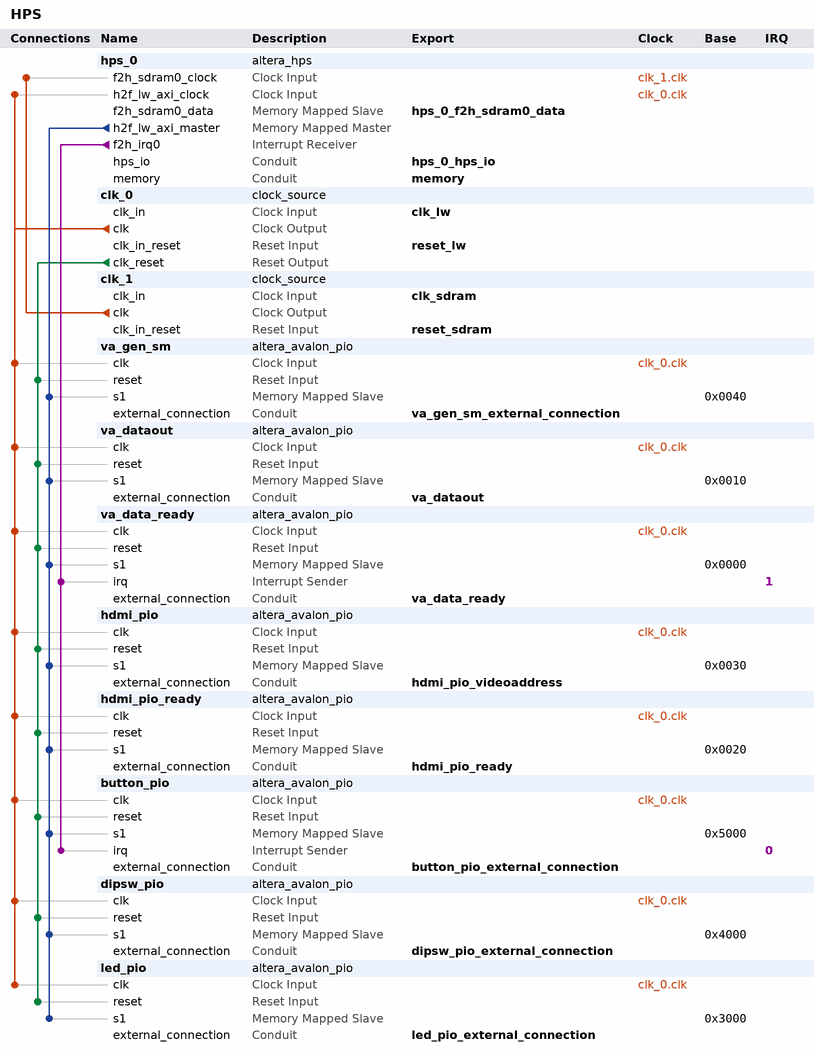
[diagram p0: system contents]
# Platform Designer (Qsys) system HPS, Cyclone V 5CSEBA6U23I7
# Parameters at their usual value, and those the tool derives, are not listed.
package require -exact qsys 16.0
create_system HPS
set_project_property DEVICE_FAMILY {Cyclone V}
set_project_property DEVICE 5CSEBA6U23I7

add_instance hps_0 altera_hps 16.0
set_instance_parameter_value hps_0 EMAC1_Mode N/A
set_instance_parameter_value hps_0 EMAC1_PinMuxing Unused
set_instance_parameter_value hps_0 F2SCLK_COLDRST_Enable false
set_instance_parameter_value hps_0 F2SCLK_DBGRST_Enable false
set_instance_parameter_value hps_0 F2SCLK_WARMRST_Enable false
set_instance_parameter_value hps_0 F2SDRAM_Type {Avalon-MM Read-Only}
set_instance_parameter_value hps_0 F2SDRAM_Width 64
set_instance_parameter_value hps_0 F2SINTERRUPT_Enable true
set_instance_parameter_value hps_0 F2S_Width 0
set_instance_parameter_value hps_0 FPGA_PERIPHERAL_OUTPUT_CLOCK_FREQ_EMAC0_GTX_CLK 100
set_instance_parameter_value hps_0 FPGA_PERIPHERAL_OUTPUT_CLOCK_FREQ_EMAC0_MD_CLK 100.0
set_instance_parameter_value hps_0 FPGA_PERIPHERAL_OUTPUT_CLOCK_FREQ_EMAC1_GTX_CLK 100
set_instance_parameter_value hps_0 FPGA_PERIPHERAL_OUTPUT_CLOCK_FREQ_EMAC1_MD_CLK 100.0
set_instance_parameter_value hps_0 HPS_PROTOCOL DDR3
set_instance_parameter_value hps_0 I2C0_Mode N/A
set_instance_parameter_value hps_0 I2C0_PinMuxing Unused
set_instance_parameter_value hps_0 I2C1_Mode N/A
set_instance_parameter_value hps_0 I2C1_PinMuxing Unused
set_instance_parameter_value hps_0 LWH2F_Enable true
set_instance_parameter_value hps_0 MEM_BANKADDR_WIDTH 3
set_instance_parameter_value hps_0 MEM_CLK_FREQ 400.0
set_instance_parameter_value hps_0 MEM_COL_ADDR_WIDTH 10
set_instance_parameter_value hps_0 MEM_DQ_WIDTH 32
set_instance_parameter_value hps_0 MEM_DRV_STR RZQ/6
set_instance_parameter_value hps_0 MEM_ROW_ADDR_WIDTH 15
set_instance_parameter_value hps_0 MEM_RTT_NOM RZQ/6
set_instance_parameter_value hps_0 MEM_RTT_WR {Dynamic ODT off}
set_instance_parameter_value hps_0 MEM_TCL 7
set_instance_parameter_value hps_0 MEM_TFAW_NS 37.5
set_instance_parameter_value hps_0 MEM_TRAS_NS 35.0
set_instance_parameter_value hps_0 MEM_TRCD_NS 13.75
set_instance_parameter_value hps_0 MEM_TRFC_NS 300.0
set_instance_parameter_value hps_0 MEM_TRP_NS 13.75
set_instance_parameter_value hps_0 MEM_VENDOR Other
set_instance_parameter_value hps_0 MEM_WTCL 7
set_instance_parameter_value hps_0 QSPI_Mode N/A
set_instance_parameter_value hps_0 QSPI_PinMuxing Unused
set_instance_parameter_value hps_0 REF_CLK_FREQ 25.0
set_instance_parameter_value hps_0 S2FCLK_USER2CLK 4
set_instance_parameter_value hps_0 S2F_Width 0
set_instance_parameter_value hps_0 SDIO_Mode {4-bit Data}
set_instance_parameter_value hps_0 SDIO_PinMuxing {HPS I/O Set 0}
set_instance_parameter_value hps_0 SPIM1_Mode N/A
set_instance_parameter_value hps_0 SPIM1_PinMuxing Unused
set_instance_parameter_value hps_0 STM_Enable false
set_instance_parameter_value hps_0 TIMING_BOARD_AC_SKEW 0.02
set_instance_parameter_value hps_0 TIMING_BOARD_AC_TO_CK_SKEW 0.0
set_instance_parameter_value hps_0 TIMING_BOARD_DQ_TO_DQS_SKEW 0.0
set_instance_parameter_value hps_0 TIMING_BOARD_MAX_CK_DELAY 0.6
set_instance_parameter_value hps_0 TIMING_BOARD_MAX_DQS_DELAY 0.6
set_instance_parameter_value hps_0 TIMING_BOARD_SKEW_BETWEEN_DQS 0.02
set_instance_parameter_value hps_0 TIMING_BOARD_SKEW_CKDQS_DIMM_MAX 0.01
set_instance_parameter_value hps_0 TIMING_BOARD_SKEW_CKDQS_DIMM_MIN -0.01
set_instance_parameter_value hps_0 TIMING_BOARD_SKEW_WITHIN_DQS 0.02
set_instance_parameter_value hps_0 TIMING_TDH 125
set_instance_parameter_value hps_0 TIMING_TDQSCK 400
set_instance_parameter_value hps_0 TIMING_TDQSQ 120
set_instance_parameter_value hps_0 TIMING_TDS 50
set_instance_parameter_value hps_0 TIMING_TIH 250
set_instance_parameter_value hps_0 TIMING_TIS 175
set_instance_parameter_value hps_0 TIMING_TQSH 0.38
set_instance_parameter_value hps_0 UART0_Mode {No Flow Control}
set_instance_parameter_value hps_0 UART0_PinMuxing {HPS I/O Set 0}
set_instance_parameter_value hps_0 USB1_Mode N/A
set_instance_parameter_value hps_0 USB1_PinMuxing Unused
set_instance_parameter_value hps_0 desired_cfg_clk_mhz 100.0
set_instance_parameter_value hps_0 desired_qspi_clk_mhz 370.0

add_instance clk_0 clock_source 16.0
set_instance_parameter_value clk_0 clockFrequency 50000000

add_instance clk_1 clock_source 16.0
set_instance_parameter_value clk_1 clockFrequency 195000000

add_instance va_gen_sm altera_avalon_pio 16.0
set_instance_parameter_value va_gen_sm direction Output
set_instance_parameter_value va_gen_sm width 32

add_instance va_dataout altera_avalon_pio 16.0
set_instance_parameter_value va_dataout direction Input
set_instance_parameter_value va_dataout width 32

add_instance va_data_ready altera_avalon_pio 16.0
set_instance_parameter_value va_data_ready captureEdge true
set_instance_parameter_value va_data_ready direction Input
set_instance_parameter_value va_data_ready generateIRQ true
set_instance_parameter_value va_data_ready irqType EDGE
set_instance_parameter_value va_data_ready width 1

add_instance hdmi_pio altera_avalon_pio 16.0
set_instance_parameter_value hdmi_pio direction Output
set_instance_parameter_value hdmi_pio width 32

add_instance hdmi_pio_ready altera_avalon_pio 16.0
set_instance_parameter_value hdmi_pio_ready direction Output
set_instance_parameter_value hdmi_pio_ready width 1

add_instance button_pio altera_avalon_pio 16.0
set_instance_parameter_value button_pio bitClearingEdgeCapReg true
set_instance_parameter_value button_pio captureEdge true
set_instance_parameter_value button_pio direction Input
set_instance_parameter_value button_pio edgeType FALLING
set_instance_parameter_value button_pio generateIRQ true
set_instance_parameter_value button_pio irqType EDGE
set_instance_parameter_value button_pio width 1

add_instance dipsw_pio altera_avalon_pio 16.0
set_instance_parameter_value dipsw_pio captureEdge true
set_instance_parameter_value dipsw_pio direction Input
set_instance_parameter_value dipsw_pio edgeType ANY
set_instance_parameter_value dipsw_pio irqType EDGE
set_instance_parameter_value dipsw_pio width 4

add_instance led_pio altera_avalon_pio 16.0
set_instance_parameter_value led_pio direction Output
set_instance_parameter_value led_pio resetValue 127
set_instance_parameter_value led_pio width 8

# connections
add_connection clk_0.clk button_pio.clk clock
add_connection clk_0.clk dipsw_pio.clk clock
add_connection clk_0.clk hdmi_pio.clk clock
add_connection clk_0.clk hdmi_pio_ready.clk clock
add_connection clk_0.clk hps_0.h2f_lw_axi_clock clock
add_connection clk_0.clk led_pio.clk clock
add_connection clk_0.clk va_data_ready.clk clock
add_connection clk_0.clk va_dataout.clk clock
add_connection clk_0.clk va_gen_sm.clk clock
add_connection clk_1.clk hps_0.f2h_sdram0_clock clock
add_connection clk_0.clk_reset button_pio.reset reset
add_connection clk_0.clk_reset dipsw_pio.reset reset
add_connection clk_0.clk_reset hdmi_pio.reset reset
add_connection clk_0.clk_reset hdmi_pio_ready.reset reset
add_connection clk_0.clk_reset led_pio.reset reset
add_connection clk_0.clk_reset va_data_ready.reset reset
add_connection clk_0.clk_reset va_dataout.reset reset
add_connection clk_0.clk_reset va_gen_sm.reset reset
add_connection hps_0.h2f_lw_axi_master button_pio.s1 avalon
set_connection_parameter_value hps_0.h2f_lw_axi_master/button_pio.s1 baseAddress 0x5000
add_connection hps_0.h2f_lw_axi_master dipsw_pio.s1 avalon
set_connection_parameter_value hps_0.h2f_lw_axi_master/dipsw_pio.s1 baseAddress 0x4000
add_connection hps_0.h2f_lw_axi_master hdmi_pio.s1 avalon
set_connection_parameter_value hps_0.h2f_lw_axi_master/hdmi_pio.s1 baseAddress 0x0030
add_connection hps_0.h2f_lw_axi_master hdmi_pio_ready.s1 avalon
set_connection_parameter_value hps_0.h2f_lw_axi_master/hdmi_pio_ready.s1 baseAddress 0x0020
add_connection hps_0.h2f_lw_axi_master led_pio.s1 avalon
set_connection_parameter_value hps_0.h2f_lw_axi_master/led_pio.s1 baseAddress 0x3000
add_connection hps_0.h2f_lw_axi_master va_data_ready.s1 avalon
set_connection_parameter_value hps_0.h2f_lw_axi_master/va_data_ready.s1 baseAddress 0x0000
add_connection hps_0.h2f_lw_axi_master va_dataout.s1 avalon
set_connection_parameter_value hps_0.h2f_lw_axi_master/va_dataout.s1 baseAddress 0x0010
add_connection hps_0.h2f_lw_axi_master va_gen_sm.s1 avalon
set_connection_parameter_value hps_0.h2f_lw_axi_master/va_gen_sm.s1 baseAddress 0x0040
add_connection hps_0.f2h_irq0 button_pio.irq interrupt
set_connection_parameter_value hps_0.f2h_irq0/button_pio.irq irqNumber 0
add_connection hps_0.f2h_irq0 va_data_ready.irq interrupt
set_connection_parameter_value hps_0.f2h_irq0/va_data_ready.irq irqNumber 1

# exported interfaces
add_interface button_pio_external_connection conduit end
set_interface_property button_pio_external_connection EXPORT_OF button_pio.external_connection
add_interface clk_lw clock sink
set_interface_property clk_lw EXPORT_OF clk_0.clk_in
add_interface clk_sdram clock sink
set_interface_property clk_sdram EXPORT_OF clk_1.clk_in
add_interface dipsw_pio_external_connection conduit end
set_interface_property dipsw_pio_external_connection EXPORT_OF dipsw_pio.external_connection
add_interface hdmi_pio_ready conduit end
set_interface_property hdmi_pio_ready EXPORT_OF hdmi_pio_ready.external_connection
add_interface hdmi_pio_videoaddress conduit end
set_interface_property hdmi_pio_videoaddress EXPORT_OF hdmi_pio.external_connection
add_interface hps_0_f2h_sdram0_data avalon slave
set_interface_property hps_0_f2h_sdram0_data EXPORT_OF hps_0.f2h_sdram0_data
add_interface hps_0_hps_io conduit end
set_interface_property hps_0_hps_io EXPORT_OF hps_0.hps_io
add_interface led_pio_external_connection conduit end
set_interface_property led_pio_external_connection EXPORT_OF led_pio.external_connection
add_interface memory conduit end
set_interface_property memory EXPORT_OF hps_0.memory
add_interface reset_lw reset sink
set_interface_property reset_lw EXPORT_OF clk_0.clk_in_reset
add_interface reset_sdram reset sink
set_interface_property reset_sdram EXPORT_OF clk_1.clk_in_reset
add_interface va_data_ready conduit end
set_interface_property va_data_ready EXPORT_OF va_data_ready.external_connection
add_interface va_dataout conduit end
set_interface_property va_dataout EXPORT_OF va_dataout.external_connection
add_interface va_gen_sm_external_connection conduit end
set_interface_property va_gen_sm_external_connection EXPORT_OF va_gen_sm.external_connection

set_interconnect_requirement {$system} qsys_mm.clockCrossingAdapter HANDSHAKE
set_interconnect_requirement {$system} qsys_mm.maxAdditionalLatency 1

save_system HPS.qsys
